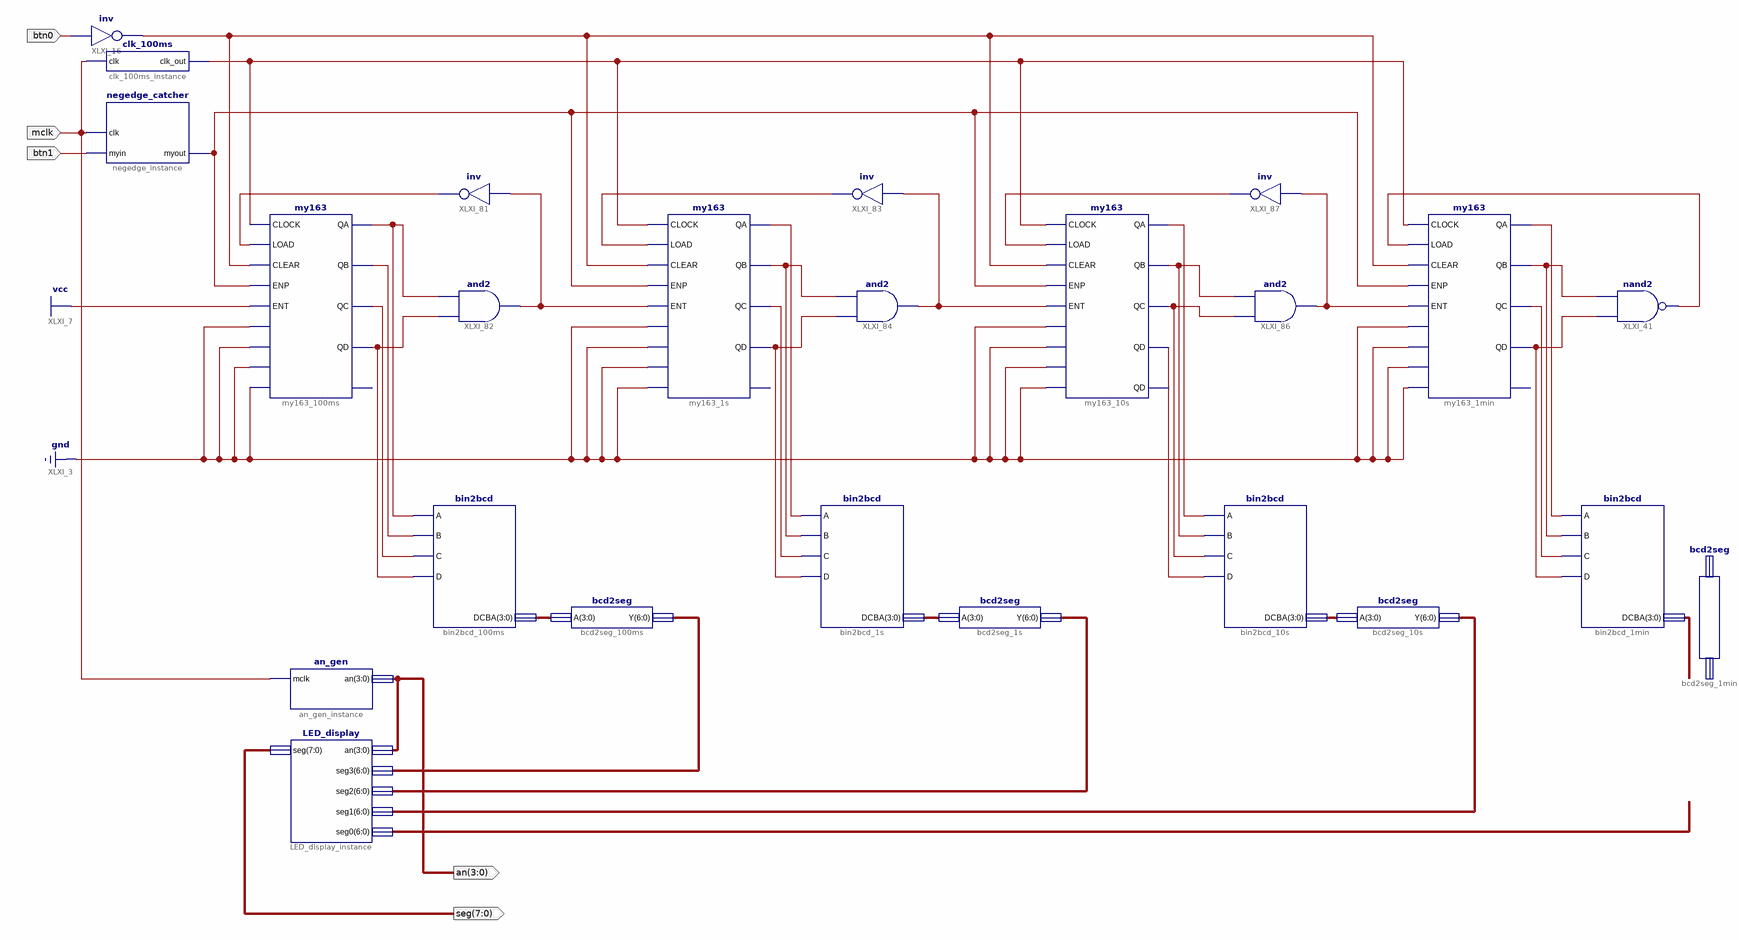
[diagram p0: schematic sheet 1]
// Xilinx ISE schematic stopwatch.sch (spartan3e) as structural Verilog: 24 symbols, 5 ports
module stopwatch (
  input  mclk,
  input  btn1,
  input  btn0,
  output [3:0] an,
  output [7:0] seg
);

  wire XLXN_18, XLXN_90, XLXN_93, XLXN_107, XLXN_110, XLXN_116, XLXN_120, XLXN_123, XLXN_124, XLXN_125,
       XLXN_126, XLXN_139, XLXN_140, XLXN_141, XLXN_142, XLXN_146, XLXN_147, XLXN_148, XLXN_149, XLXN_155,
       XLXN_156, XLXN_157, XLXN_158, XLXN_187, XLXN_188, XLXN_189;
  wire [3:0] XLXN_127, XLXN_131, XLXN_132, XLXN_133;
  wire [6:0] XLXN_164, XLXN_165, XLXN_166, XLXN_167;

  my163 my163_100ms (
    .DATAC(1'b0), .DATAD(1'b0), .QD(XLXN_126), .CLOCK(XLXN_120), .LOAD(XLXN_18), .CLEAR(XLXN_116),
    .ENP(XLXN_107), .ENT(1'b1), .DATAB(1'b0), .DATAA(1'b0), .QA(XLXN_123), .QB(XLXN_124), .QC(XLXN_125));  // open: C
  my163 my163_1s (
    .DATAC(1'b0), .DATAD(1'b0), .QD(XLXN_142), .CLOCK(XLXN_120), .LOAD(XLXN_90), .CLEAR(XLXN_116),
    .ENP(XLXN_107), .ENT(XLXN_187), .DATAB(1'b0), .DATAA(1'b0), .QA(XLXN_139), .QB(XLXN_140), .QC(XLXN_141));  // open: C
  negedge_catcher negedge_instance (.clk(mclk), .myin(btn1), .myout(XLXN_107));
  not XLXI_16 (XLXN_116, btn0);
  my163 my163_10s (
    .DATAC(1'b0), .DATAD(1'b0), .QD(XLXN_149), .CLOCK(XLXN_120), .LOAD(XLXN_93), .CLEAR(XLXN_116),
    .ENP(XLXN_107), .ENT(XLXN_188), .DATAB(1'b0), .DATAA(1'b0), .QA(XLXN_146), .QB(XLXN_147), .QC(XLXN_148));  // open: C
  my163 my163_1min (
    .DATAC(1'b0), .DATAD(1'b0), .QD(XLXN_158), .CLOCK(XLXN_120), .LOAD(XLXN_110), .CLEAR(XLXN_116),
    .ENP(XLXN_107), .ENT(XLXN_189), .DATAB(1'b0), .DATAA(1'b0), .QA(XLXN_155), .QB(XLXN_156), .QC(XLXN_157));  // open: C
  nand XLXI_41 (XLXN_110, XLXN_158, XLXN_156);
  clk_100ms clk_100ms_instance (.clk(mclk), .clk_out(XLXN_120));
  bin2bcd bin2bcd_100ms (.A(XLXN_123), .B(XLXN_124), .C(XLXN_125), .D(XLXN_126), .DCBA(XLXN_127));
  bcd2seg bcd2seg_100ms (.A(XLXN_127), .Y(XLXN_164));
  an_gen an_gen_instance (.mclk(mclk), .an(an));
  bin2bcd bin2bcd_1s (.A(XLXN_139), .B(XLXN_140), .C(XLXN_141), .D(XLXN_142), .DCBA(XLXN_131));
  bcd2seg bcd2seg_1s (.A(XLXN_131), .Y(XLXN_165));
  bin2bcd bin2bcd_10s (.A(XLXN_146), .B(XLXN_147), .C(XLXN_148), .D(XLXN_149), .DCBA(XLXN_132));
  bcd2seg bcd2seg_10s (.A(XLXN_132), .Y(XLXN_166));
  bin2bcd bin2bcd_1min (.A(XLXN_155), .B(XLXN_156), .C(XLXN_157), .D(XLXN_158), .DCBA(XLXN_133));
  bcd2seg bcd2seg_1min (.A(XLXN_133), .Y(XLXN_167));
  LED_display LED_display_instance (
    .an(an), .seg3(XLXN_164), .seg2(XLXN_165), .seg1(XLXN_166), .seg0(XLXN_167), .seg(seg));
  not XLXI_81 (XLXN_18, XLXN_187);
  and XLXI_82 (XLXN_187, XLXN_126, XLXN_123);
  not XLXI_83 (XLXN_90, XLXN_188);
  and XLXI_84 (XLXN_188, XLXN_142, XLXN_140);
  and XLXI_86 (XLXN_189, XLXN_148, XLXN_147);
  not XLXI_87 (XLXN_93, XLXN_189);
endmodule
